# Altium schematic sheet [06] Output.SchDoc
size A
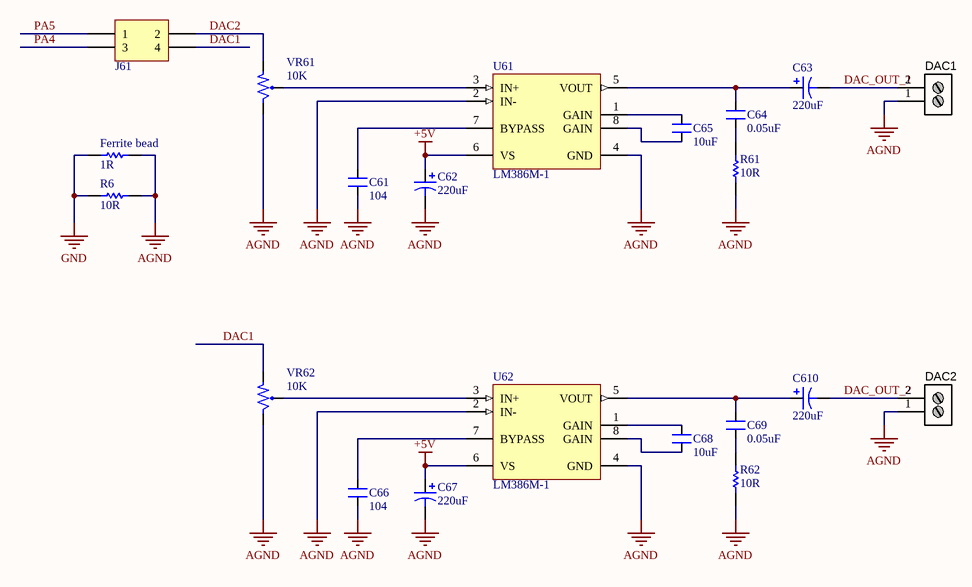
[diagram p0: [06] Output.SchDoc]

## Parts
C61  value 104  [CAPC1608N]  (hidden comment: CAP NP)
C62  value 220uF  [CAP 3.8mm]  (hidden comment: Cap)
C63  value 220uF  [CAP 3.8mm]  (hidden comment: Cap)
C64  value 0.05uF  [CAPC2012N_F]  (hidden comment: CAP NP)
C65  value 10uF  [CAPC2012N_F]  (hidden comment: CAP NP)
C66  value 104  [CAPC1608N]  (hidden comment: CAP NP)
C67  value 220uF  [CAP 3.8mm]  (hidden comment: Cap)
C68  value 10uF  [CAPC2012N_F]  (hidden comment: CAP NP)
C69  value 0.05uF  [CAPC2012N_F]  (hidden comment: CAP NP)
C610  value 220uF  [CAP 3.8mm]  (hidden comment: Cap)
DAC1  Stackable ScrewTerm  [2P_PCB_ScrewTerm_200mil]  (value not drawn)
DAC2  Stackable ScrewTerm  [2P_PCB_ScrewTerm_200mil]  (value not drawn)
Ferrite_bead  value 1R  [RESTH_0.0R_AXIAL-0.6]  (hidden comment: Res)
J61  Header 2X2  [HDR2X2]  (value not drawn)
R6  value 10R  [RESTH_0.0R_AXIAL-0.6]  (hidden comment: Res)
R61  value 10R  [RESC2012N_F]  (hidden comment: Res)
R62  value 10R  [RESC2012N_F]  (hidden comment: Res)
U61  LM386M-1  [M08A_N]
U62  LM386M-1  [M08A_N]
VR61  10K  [VR1]
VR62  10K  [VR1]

## Nets
+5V: C62.1 C67.1 U61.6(VS) U62.6(VS)
AGND: C61.1 C62.2 C66.1 C67.2 DAC1.1 DAC2.1 Ferrite_bead.2 R6.2 R61.1 R62.1 U61.2(IN-) U61.4(GND) U62.2(IN-) U62.4(GND) VR61.3 VR62.3
GND: Ferrite_bead.1 R6.1
DAC1: J61.4 VR62.1
DAC2: J61.2 VR61.1
DAC_OUT_1: C63.2 DAC1.2
DAC_OUT_2: C610.2 DAC2.2
PA4: J61.3
PA5: J61.1
NetC61_2: C61.2 U61.7(BYPASS)
NetC63_1: C63.1 C64.1 U61.5(VOUT)
NetC64_2: C64.2 R61.2
NetC65_1: C65.1 U61.8(GAIN)
NetC65_2: C65.2 U61.1(GAIN)
NetC66_2: C66.2 U62.7(BYPASS)
NetC68_1: C68.1 U62.8(GAIN)
NetC68_2: C68.2 U62.1(GAIN)
NetC69_1: C69.1 C610.1 U62.5(VOUT)
NetC69_2: C69.2 R62.2
NetU61_3: U61.3(IN+) VR61.2
NetU62_3: U62.3(IN+) VR62.2

## Library data of the parts
DAC1 DAC2 = 2P_ScrewTerm_90S_3.81MM: Terminal Block Screw Type THT 2-Position 3.81mm pitch; Manufacturer 1: Tyco Electronics; Manufacturer Part Number 1: 1776113-2; Value: 2 position; Pitch: 0.150" (3.81mm); Positions Per Level: 2; Package / Case: Side Entry; 3.81mm pitch; Category: Connectors Interconnects; Color: Black; Supplier 1: Digi-Key; Supplier Part Number 1: A97976-ND
J61 = Header 2X2: Header, 2-Pin, Dual row; LatestRevisionDate: 17-Jul-2002; LatestRevisionNote: Re-released for DXP Platform.; Publisher: Altium Limited
U61 U62 = LM386M-1: Low Voltage Audio Power Amplifier; Manufacturer: National Semiconductor; CompType: Audio IC; PackageTopMarking: NSZXTT*LM386*M-1; PowerWise: N; Published: 4-Dec-2008; DatasheetVersion: Aug-2000; PackageVersion: revL, Sep-2006; PackageReference: M08A; Publisher: Altium Limited; PackageDescription: SOIC Narrow, 4.9 x 3.9 x 1.45mm, 8 Lead, 1.27mm Pitch; PartNumber: LM386M-1; RoHS: O; PinCount: 8; DigiKeyPartNumber: LM386M-1-ND; Code_JEDEC: MS-012-AA; Code_IPC: SOIC127P600-8; ComponentLink1Description: LM386 Datasheet; ComponentLink1URL: http://www.national.com/ds/LM/LM386.pdf; ComponentLink2Description: LM386 Web Page; ComponentLink2URL: http://www.national.com/pf/LM/LM386.html; ComponentLink3Description: M08A Package Page; ComponentLink3URL: http://www.national.com/packaging/folders/m08a.html
VR61 VR62 = VR1: Var Resistor; Value: VR 10K